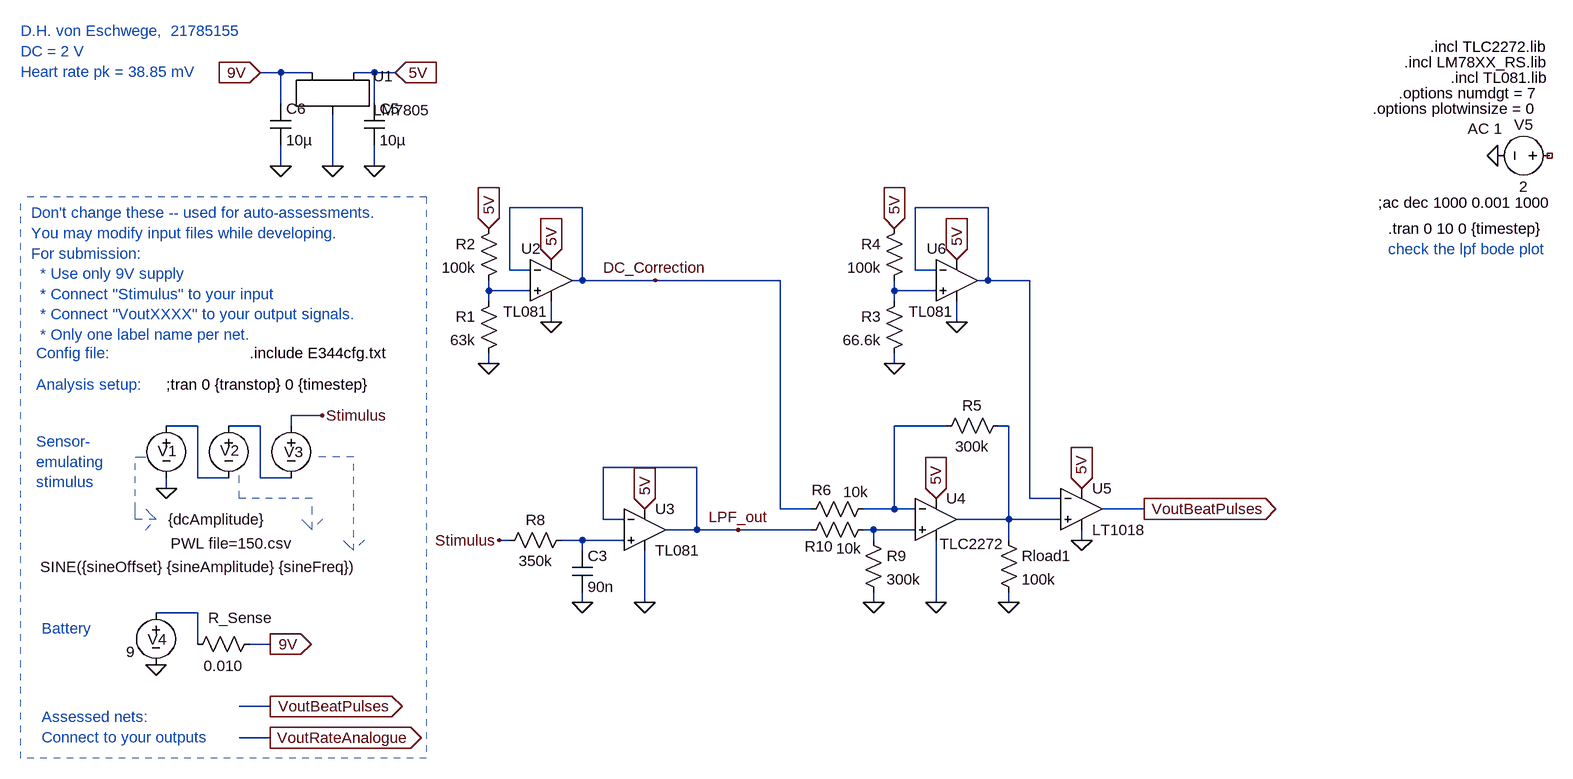
[diagram p0: schematic X_1stOrderFilter .asc]
X_1stOrderFilter .asc, the LTspice schematic file:
Version 4
SHEET 1 1824 680
WIRE -1904 -1600 -1936 -1600
WIRE -1856 -1600 -1904 -1600
WIRE -1760 -1600 -1792 -1600
WIRE -1728 -1600 -1760 -1600
WIRE -1904 -1552 -1904 -1600
WIRE -1760 -1552 -1760 -1600
WIRE -1904 -1456 -1904 -1488
WIRE -1824 -1456 -1824 -1536
WIRE -1760 -1456 -1760 -1488
WIRE -1440 -1392 -1552 -1392
WIRE -816 -1392 -928 -1392
WIRE -1552 -1296 -1552 -1392
WIRE -1520 -1296 -1552 -1296
WIRE -928 -1296 -928 -1392
WIRE -896 -1296 -928 -1296
WIRE -1440 -1280 -1440 -1392
WIRE -1440 -1280 -1456 -1280
WIRE -1328 -1280 -1440 -1280
WIRE -1136 -1280 -1328 -1280
WIRE -816 -1280 -816 -1392
WIRE -816 -1280 -832 -1280
WIRE -752 -1280 -816 -1280
WIRE -1584 -1264 -1584 -1280
WIRE -1520 -1264 -1584 -1264
WIRE -960 -1264 -960 -1280
WIRE -896 -1264 -960 -1264
WIRE -1584 -1248 -1584 -1264
WIRE -960 -1248 -960 -1264
WIRE -1488 -1216 -1488 -1248
WIRE -864 -1216 -864 -1248
WIRE -1584 -1152 -1584 -1168
WIRE -960 -1152 -960 -1168
WIRE -1840 -1072 -1888 -1072
WIRE -2032 -1056 -2080 -1056
WIRE -1936 -1056 -1984 -1056
WIRE -1888 -1056 -1888 -1072
WIRE -880 -1056 -960 -1056
WIRE -784 -1056 -800 -1056
WIRE -1264 -992 -1408 -992
WIRE -2032 -976 -2032 -1056
WIRE -1984 -976 -2032 -976
WIRE -1936 -976 -1936 -1056
WIRE -1888 -976 -1936 -976
WIRE -2080 -960 -2080 -976
WIRE -752 -944 -752 -1280
WIRE -704 -944 -752 -944
WIRE -1136 -928 -1136 -1280
WIRE -1088 -928 -1136 -928
WIRE -960 -928 -960 -1056
WIRE -960 -928 -1008 -928
WIRE -928 -928 -960 -928
WIRE -576 -928 -640 -928
WIRE -1408 -912 -1408 -992
WIRE -1376 -912 -1408 -912
WIRE -784 -912 -784 -1056
WIRE -784 -912 -864 -912
WIRE -704 -912 -784 -912
WIRE -1264 -896 -1264 -992
WIRE -1264 -896 -1312 -896
WIRE -1200 -896 -1264 -896
WIRE -1088 -896 -1200 -896
WIRE -992 -896 -1008 -896
WIRE -928 -896 -992 -896
WIRE -1552 -880 -1568 -880
WIRE -1440 -880 -1472 -880
WIRE -1376 -880 -1440 -880
WIRE -992 -880 -992 -896
WIRE -784 -880 -784 -912
WIRE -672 -880 -672 -896
WIRE -1440 -864 -1440 -880
WIRE -1440 -784 -1440 -800
WIRE -1344 -784 -1344 -864
WIRE -992 -784 -992 -800
WIRE -896 -784 -896 -880
WIRE -784 -784 -784 -800
WIRE -2032 -768 -2096 -768
WIRE -2032 -720 -2032 -768
WIRE -1920 -720 -1952 -720
WIRE -1920 -624 -1968 -624
WIRE -1920 -576 -1968 -576
FLAG -2080 -960 0
FLAG -1840 -1072 Stimulus
FLAG -1920 -720 9V
IOPIN -1920 -720 Out
FLAG -2096 -688 0
FLAG -1920 -624 VoutBeatPulses
IOPIN -1920 -624 Out
FLAG -1920 -576 VoutRateAnalogue
IOPIN -1920 -576 Out
FLAG -1824 -1456 0
FLAG -1344 -784 0
FLAG -1440 -784 0
FLAG -1936 -1600 9V
IOPIN -1936 -1600 In
FLAG -1904 -1456 0
FLAG -1760 -1456 0
FLAG -1728 -1600 5V
IOPIN -1728 -1600 In
FLAG -1344 -928 5V
IOPIN -1344 -928 In
FLAG -32 -1472 0
FLAG -576 -928 VoutBeatPulses
IOPIN -576 -928 Out
FLAG -1568 -880 Stimulus
FLAG -784 -784 0
FLAG -896 -784 0
FLAG -992 -784 0
FLAG -1200 -896 LPF_out
FLAG -1584 -1152 0
FLAG -1584 -1360 5V
IOPIN -1584 -1360 In
FLAG -1488 -1216 0
FLAG -896 -944 5V
IOPIN -896 -944 In
FLAG -1488 -1312 5V
IOPIN -1488 -1312 In
FLAG -1328 -1280 DC_Correction
FLAG -960 -1152 0
FLAG -960 -1360 5V
IOPIN -960 -1360 In
FLAG -864 -1216 0
FLAG -864 -1312 5V
IOPIN -864 -1312 In
FLAG -672 -960 5V
IOPIN -672 -960 In
FLAG -672 -880 0
SYMBOL voltage -1984 -1072 R0
WINDOW 123 0 0 Left 0
WINDOW 39 0 0 Left 0
WINDOW 3 -89 197 Left 2
WINDOW 0 -13 54 Left 2
SYMATTR Value PWL file=150.csv
SYMATTR InstName V2
SYMBOL voltage -1888 -1072 R0
WINDOW 123 24 44 Left 2
WINDOW 39 0 0 Left 0
WINDOW 3 -386 233 Left 2
WINDOW 0 -11 56 Left 2
SYMATTR Value SINE({sineOffset} {sineAmplitude} {sineFreq})
SYMATTR InstName V3
SYMBOL voltage -2080 -1072 R0
WINDOW 123 0 0 Left 0
WINDOW 39 0 0 Left 0
WINDOW 3 3 160 Left 2
WINDOW 0 -13 55 Left 2
SYMATTR Value {dcAmplitude}
SYMATTR InstName V1
SYMBOL voltage -2096 -784 R0
WINDOW 123 24 44 Left 2
WINDOW 39 0 0 Left 0
WINDOW 3 -46 76 Left 2
WINDOW 0 -13 57 Left 2
SYMATTR Value 9
SYMATTR InstName V4
SYMBOL res -1936 -736 R90
WINDOW 0 -9 30 VBottom 2
WINDOW 3 34 56 VTop 2
SYMATTR InstName R_Sense
SYMATTR Value 0.010
SYMBOL LM7805 -1824 -1584 R0
SYMATTR InstName U1
SYMBOL cap -1456 -864 R0
SYMATTR InstName C3
SYMATTR Value 90n
SYMBOL Opamps\\opamp2 -1344 -960 R0
SYMATTR InstName U3
SYMATTR Value TL081
SYMBOL res -1456 -896 R90
WINDOW 0 0 56 VBottom 2
WINDOW 3 32 56 VTop 2
SYMATTR InstName R8
SYMATTR Value 350k
SYMBOL cap -1776 -1552 R0
SYMATTR InstName C5
SYMATTR Value 10µ
SYMBOL cap -1920 -1552 R0
SYMATTR InstName C6
SYMATTR Value 10µ
SYMBOL voltage 64 -1472 R90
WINDOW 0 -32 56 VBottom 2
WINDOW 3 32 56 VTop 2
WINDOW 123 -26 115 VBottom 2
WINDOW 39 0 0 Left 0
SYMATTR InstName V5
SYMATTR Value 2
SYMATTR Value2 AC 1
SYMBOL res -800 -896 R0
SYMATTR InstName Rload1
SYMATTR Value 100k
SYMBOL res -784 -1072 R90
WINDOW 0 0 56 VBottom 2
WINDOW 3 32 56 VTop 2
SYMATTR InstName R5
SYMATTR Value 300k
SYMBOL res -992 -944 R90
WINDOW 0 2 80 VBottom 2
WINDOW 3 -26 27 VTop 2
SYMATTR InstName R6
SYMATTR Value 10k
SYMBOL Opamps\\opamp2 -896 -976 R0
WINDOW 3 6 102 Left 2
SYMATTR Value TLC2272
SYMATTR InstName U4
SYMBOL res -1008 -896 R0
SYMATTR InstName R9
SYMATTR Value 300k
SYMBOL res -992 -912 R90
WINDOW 0 57 84 VBottom 2
WINDOW 3 29 38 VTop 2
SYMATTR InstName R10
SYMATTR Value 10k
SYMBOL res -1568 -1264 M0
SYMATTR InstName R1
SYMATTR Value 63k
SYMBOL res -1568 -1376 M0
SYMATTR InstName R2
SYMATTR Value 100k
SYMBOL Opamps\\opamp2 -1488 -1344 R0
WINDOW 0 -46 15 Left 2
WINDOW 3 -74 112 Left 2
SYMATTR InstName U2
SYMATTR Value TL081
SYMBOL Comparators\\LT1018 -672 -928 R0
SYMATTR InstName U5
SYMBOL res -944 -1264 M0
SYMATTR InstName R3
SYMATTR Value 66.6k
SYMBOL res -944 -1376 M0
SYMATTR InstName R4
SYMATTR Value 100k
SYMBOL Opamps\\opamp2 -864 -1344 R0
WINDOW 0 -46 15 Left 2
WINDOW 3 -74 112 Left 2
SYMATTR InstName U6
SYMATTR Value TL081
TEXT -2080 -1120 Left 2 !;tran 0 {transtop} 0 {timestep}
TEXT -1952 -1168 Left 2 !.include E344cfg.txt
TEXT -2288 -1384 Left 2 ;Don't change these -- used for auto-assessments.\nYou may modify input files while developing.\nFor submission: \n  * Use only 9V supply \n  * Connect "Stimulus" to your input\n  * Connect "VoutXXXX" to your output signals.\n  * Only one label name per net.
TEXT -2280 -1168 Left 2 ;Config file:
TEXT -2280 -1120 Left 2 ;Analysis setup:
TEXT -2272 -744 Left 2 ;Battery
TEXT -2280 -1032 Left 2 ;Sensor-\nemulating \nstimulus
TEXT -2272 -608 Left 2 ;Assessed nets:\nConnect to your outputs
TEXT -2304 -1664 Left 2 ;D.H. von Eschwege,  21785155\nDC = 2 V\nHeart rate pk = 38.85 mV
TEXT -136 -1640 Left 2 !.incl TLC2272.lib
TEXT -176 -1616 Left 2 !.incl LM78XX_RS.lib
TEXT -104 -1592 Left 2 !.incl TL081.lib
TEXT -184 -1568 Left 2 !.options numdgt = 7
TEXT -224 -1544 Left 2 !.options plotwinsize = 0
TEXT -216 -1400 Left 2 !;ac dec 1000 0.001 1000
TEXT -200 -1360 Left 2 !.tran 0 10 0 {timestep}
TEXT -200 -1328 Left 2 ;check the lpf bode plot
LINE Normal -1792 -1008 -1856 -1008 2
LINE Normal -1792 -864 -1792 -1008 2
LINE Normal -1808 -880 -1792 -864 2
LINE Normal -1792 -864 -1808 -880 2
LINE Normal -1776 -880 -1792 -864 2
LINE Normal -2128 -1008 -2112 -1008 2
LINE Normal -2128 -928 -2128 -1008 2
LINE Normal -2128 -912 -2128 -928 2
LINE Normal -2096 -912 -2128 -912 2
LINE Normal -2112 -928 -2096 -912 2
LINE Normal -2096 -912 -2112 -928 2
LINE Normal -2112 -896 -2096 -912 2
LINE Normal -1968 -944 -1968 -992 2
LINE Normal -1856 -944 -1968 -944 2
LINE Normal -1856 -896 -1856 -944 2
LINE Normal -1872 -912 -1856 -896 2
LINE Normal -1856 -896 -1872 -912 2
LINE Normal -1840 -912 -1856 -896 2
LINE Normal -2304 -544 -2304 -1408 1
LINE Normal -1680 -1408 -1680 -544 1
LINE Normal -1680 -544 -2304 -544 1
LINE Normal -1680 -1408 -2304 -1408 1

The netlist it stands for:
* X_1stOrderFilter .asc
V2 N005 N004 PWL file=150.csv
V3 Stimulus N005 SINE({sineOffset} {sineAmplitude} {sineFreq})
V1 N004 0 {dcAmplitude}
V4 N010 0 9
R_Sense 9V N010 0.010
XU1 9V 0 5V LM7805
C3 N009 0 90n
XU3 N009 LPF_out 5V 0 LPF_out TL081  ; pins In+ In- V+ V- OUT
R8 N009 Stimulus 350k
C5 5V 0 10µ
C6 9V 0 10µ
V5 NC_01 0 2 AC 1
Rload1 N007 0 100k
R5 N007 N006 300k
R6 N006 DC_Correction 10k
XU4 N008 N006 5V 0 N007 TLC2272  ; pins In+ In- V+ V- OUT
R9 N008 0 300k
R10 N008 LPF_out 10k
R1 N002 0 63k
R2 5V N002 100k
XU2 N002 DC_Correction 5V 0 DC_Correction TL081  ; pins In+ In- V+ V- OUT
XU5 N007 N001 5V 0 VoutBeatPulses LT1018  ; pins In+ In- V+ V- OUT
R3 N003 0 66.6k
R4 5V N003 100k
XU6 N003 N001 5V 0 N001 TL081  ; pins In+ In- V+ V- OUT
;tran 0 {transtop} 0 {timestep}
.include E344cfg.txt
* Don't change these -- used for auto-assessments.
* You may modify input files while developing.
* For submission:
*   * Use only 9V supply
*   * Connect "Stimulus" to your input
*   * Connect "VoutXXXX" to your output signals.
*   * Only one label name per net.
* Config file:
* Analysis setup:
* Battery
* Sensor-
* emulating
* stimulus
* Assessed nets:
* Connect to your outputs
* D.H. von Eschwege,  21785155
* DC = 2 V
* Heart rate pk = 38.85 mV
.incl TLC2272.lib
.incl LM78XX_RS.lib
.incl TL081.lib
.options numdgt = 7
.options plotwinsize = 0
;ac dec 1000 0.001 1000
.tran 0 10 0 {timestep}
* check the lpf bode plot
.lib LTC1.lib
.backanno
.end